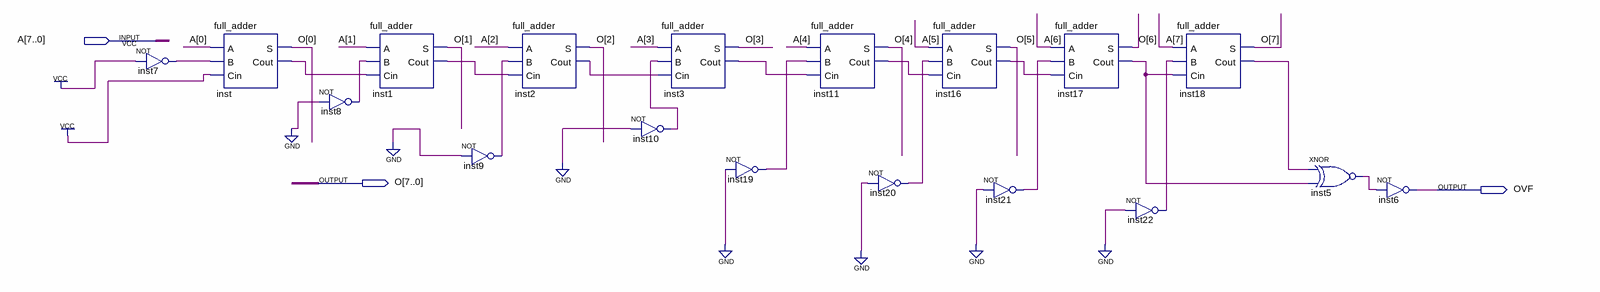
[diagram p0: schematic sheet]
// Quartus schematic SUB1_8BITS.bdf as structural Verilog: 18 symbols, 3 pins
module SUB1_8BITS (
  input  [7:0] A,
  output [7:0] O,
  output OVF
);

  wire inst1_cout, inst2_cout, inst3_cout, inst5_out, inst7_out, inst8_out, inst9_out, inst10_out,
       inst11_cout, inst16_cout, inst17_cout, inst18_cout, inst19_out, inst20_out, inst21_out, inst22_out,
       inst_cout;

  not inst7 (inst7_out, 1'b1);
  full_adder inst (.A(A[0]), .B(inst7_out), .Cin(1'b1), .S(O[0]), .Cout(inst_cout));
  not inst8 (inst8_out, 1'b0);
  full_adder inst1 (.A(A[1]), .B(inst8_out), .Cin(inst_cout), .S(O[1]), .Cout(inst1_cout));
  not inst9 (inst9_out, 1'b0);
  full_adder inst2 (.A(A[2]), .B(inst9_out), .Cin(inst1_cout), .S(O[2]), .Cout(inst2_cout));
  full_adder inst3 (.A(A[3]), .B(inst10_out), .Cin(inst2_cout), .S(O[3]), .Cout(inst3_cout));
  not inst10 (inst10_out, 1'b0);
  not inst19 (inst19_out, 1'b0);
  full_adder inst11 (.A(A[4]), .B(inst19_out), .Cin(inst3_cout), .S(O[4]), .Cout(inst11_cout));
  not inst20 (inst20_out, 1'b0);
  full_adder inst16 (.A(A[5]), .B(inst20_out), .Cin(inst11_cout), .S(O[5]), .Cout(inst16_cout));
  not inst21 (inst21_out, 1'b0);
  full_adder inst17 (.A(A[6]), .B(inst21_out), .Cin(inst16_cout), .S(O[6]), .Cout(inst17_cout));
  not inst22 (inst22_out, 1'b0);
  full_adder inst18 (.A(A[7]), .B(inst22_out), .Cin(inst17_cout), .S(O[7]), .Cout(inst18_cout));
  xnor inst5 (inst5_out, inst18_cout, inst17_cout);
  not inst6 (OVF, inst5_out);
endmodule
